# EasyEDA Pro project ProPrj_农装B类小车V2_2025-10-25.epro, board PCB8
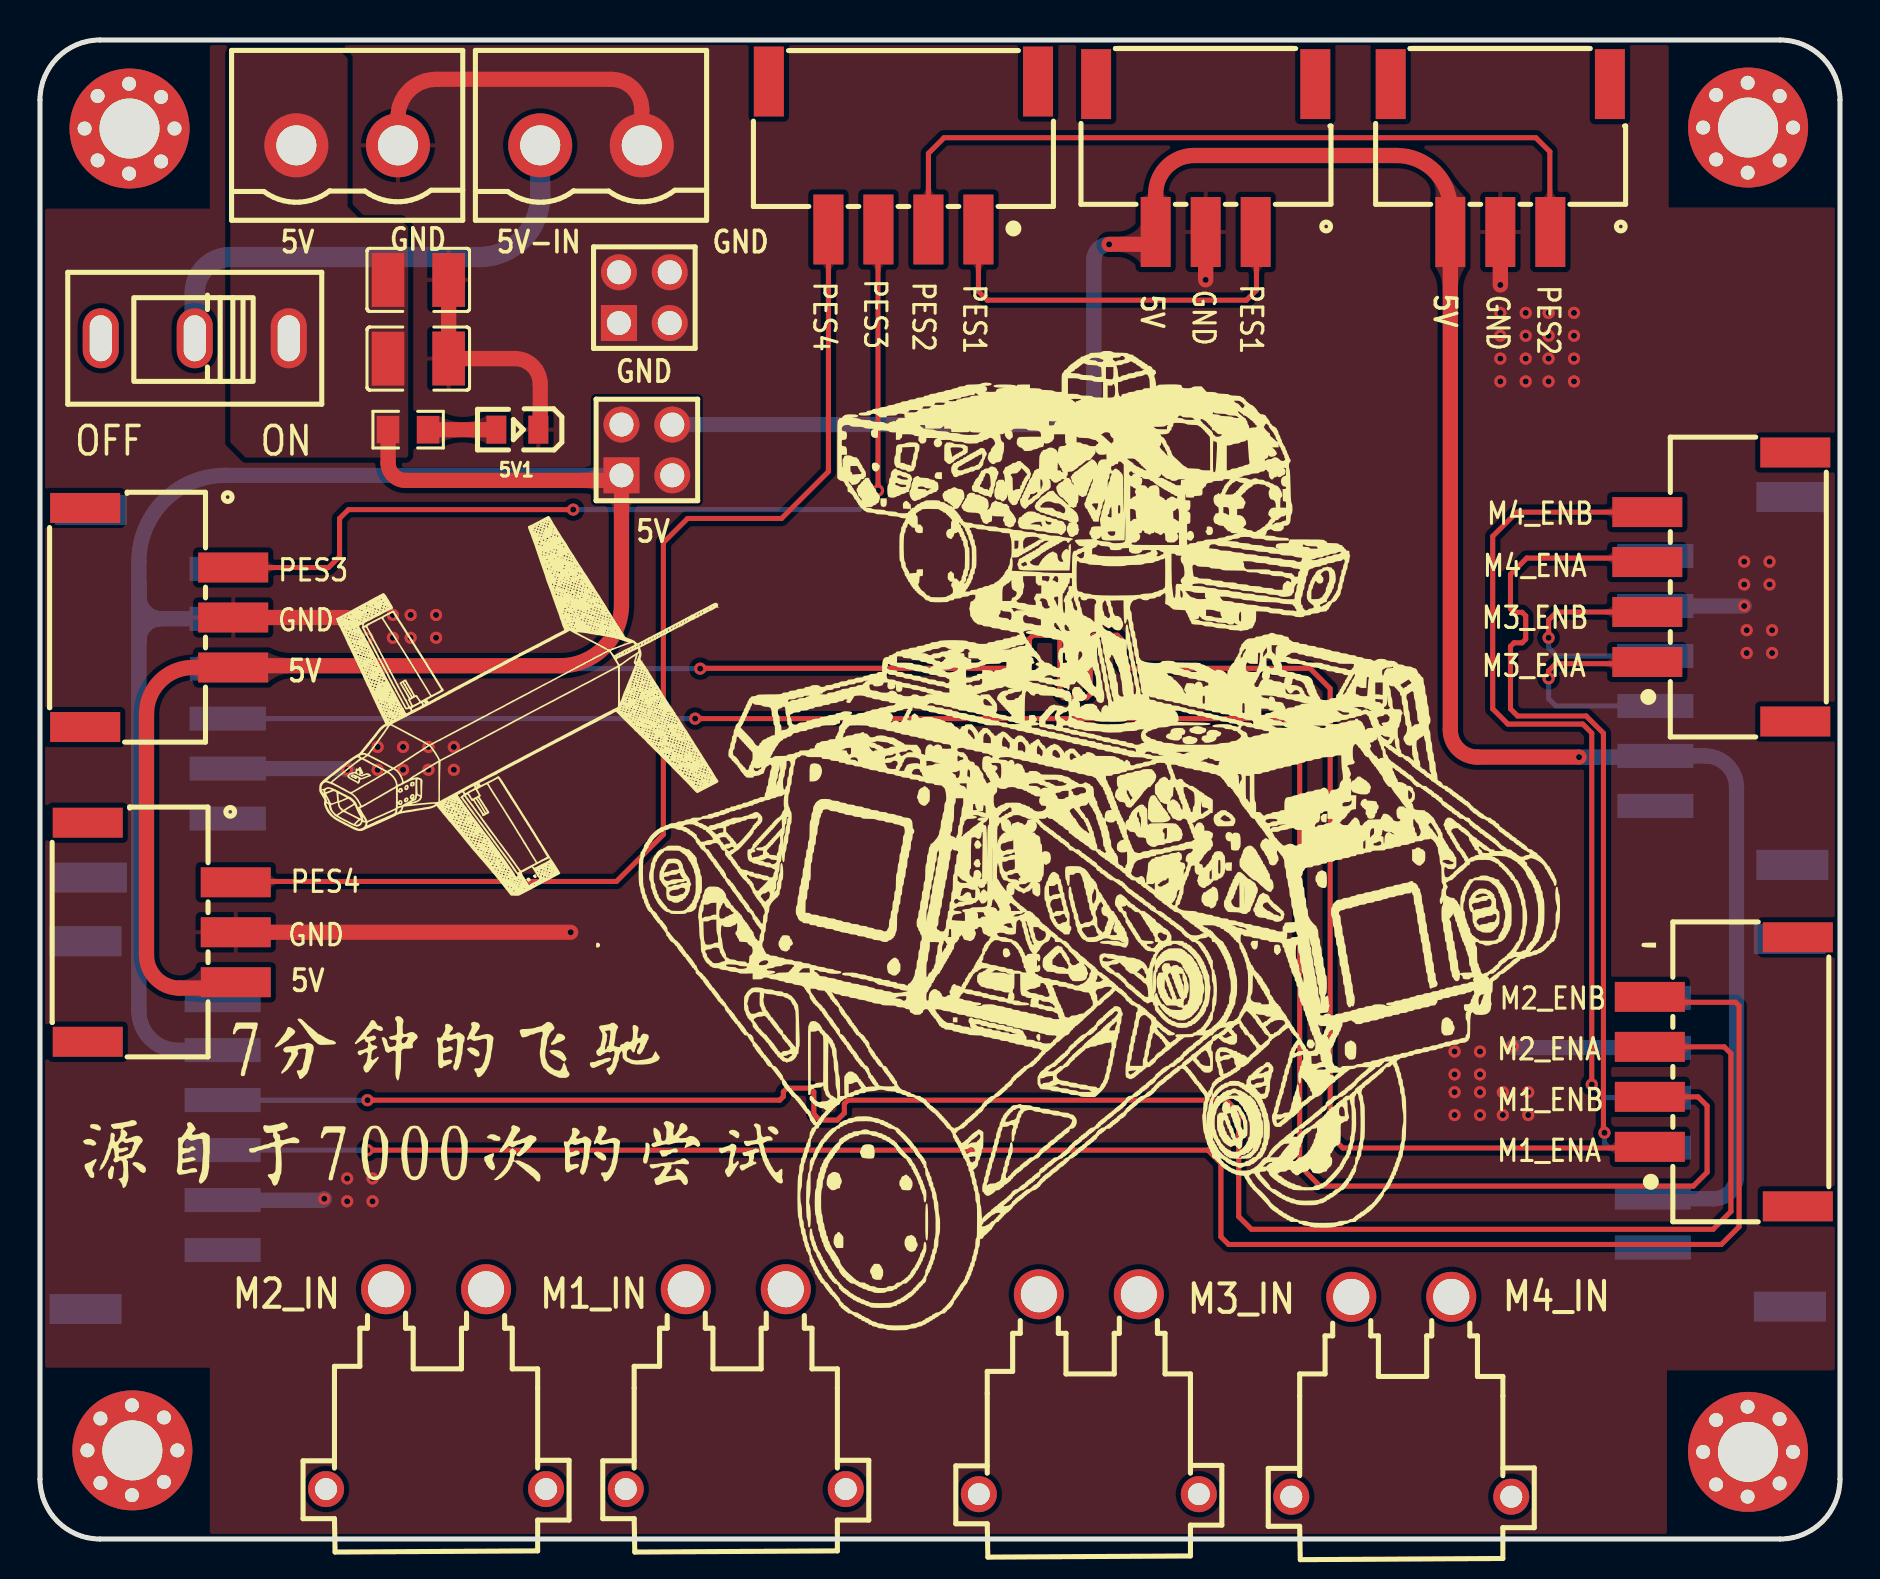
[diagram p4: board, top side]
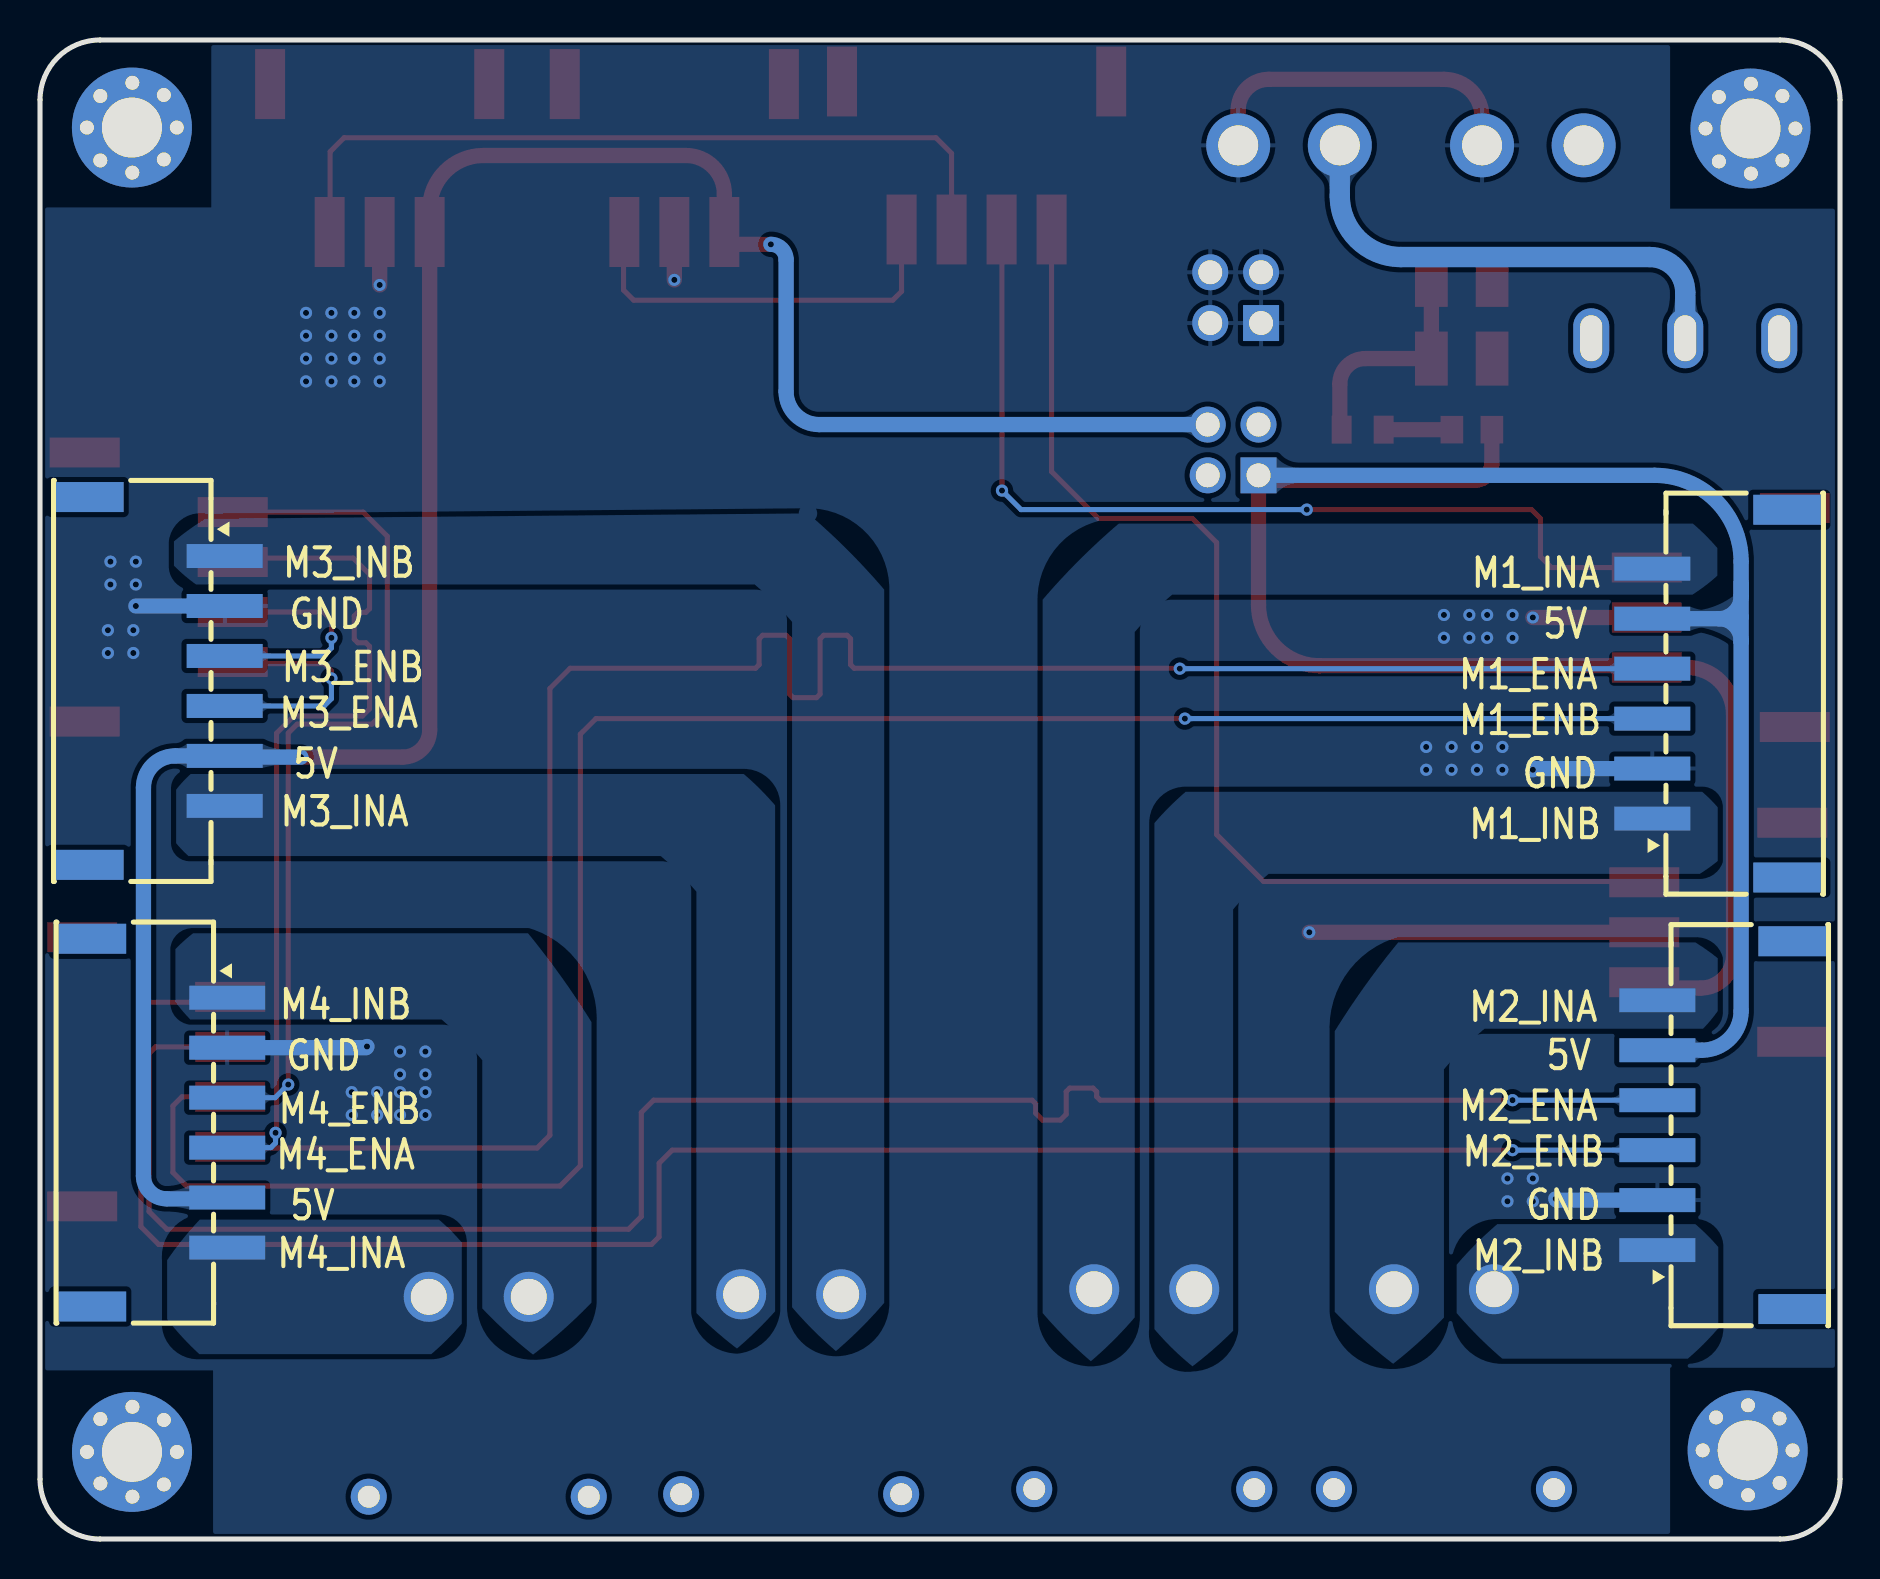
[diagram p5: board, bottom side, seen from below]

Outline 90 x 75 mm; copper layers: Top Layer, Bottom Layer. Coordinates in mm from the lower left corner of the outline.
Outline path: 0,72 arc(0.88,74.12) 3,75 87,75 arc(89.12,74.12) 90,72 90,3 arc(89.12,0.88) 87,0 3,0 arc(0.88,0.88) 0,3 0,72
Stack: Top Layer 0.035mm / Dielectric1 1.51mm FR4 er 4.5 / Bottom Layer 0.035mm

## Design rules (mm)
net M1_ENA: DP2
net M1_ENB: DP2
net M2_ENA: DP1
net M2_ENB: DP1
net M3_ENA: DP3
net M3_ENB: DP3
net M4_ENA: DP4
net M4_ENB: DP4
template: JLCPCB Capability(Two Layers Board)
spacing copperThickness1oz (default): track to track 0.102, other pairs 0.152 to 0.3
spacing copperThickness2oz: track to track 0.203, other pairs 0.152 to 0.3
track width copperThickness1oz (default): min 0.127, default 0.254, max 2.54
track width copperThickness2oz: min 0.203, default 0.254, max 2.54
differential pair differentialPair (default): width min 0.127, default 0.254, max 2.54; gap min 0.152, default 0.152
via viaSize (default): diameter min 0.5, default 0.61, max 10; hole min 0.3, default 0.305, max 6.3

## Placement (name value [footprint] x y rotation side)
5V1  NCD0805R1  [LED0805-R-RD]  23.87 55.5 180 top
C54  100uF  [C1210]  18.91 63 0 top
C55  100uF  [C1210]  18.91 59.06 0 top
CN2  DB2EVC-5.08-2P-GN  [CONN-TH_2P-P5.08_DB2EVC-5.08-2P]  27.55 69.73 180 top
CN15  WAFER-XH2.54-4PWB  [CONN-TH_4P-P0.20_XUNPU_WAFER-XH2.54-4PWB]  43.17 69.22 180 top
CN19  WAFER-XH2.54-3PWB  [CONN-SMD_3P-P2.50_XUNPU_WAFER-XH2.54-3PWB]  58.28 69.09 180 top
CN27  WAFER-XH2.54-3PWB  [CONN-SMD_3P-P2.50_XUNPU_WAFER-XH2.54-3PWB]  73.02 69.09 180 top
CN28  WAFER-XH2.54-3PWB  [CONN-SMD_3P-P2.50_XUNPU_WAFER-XH2.54-3PWB]  5.96 46.11 270 top
CN29  WAFER-XH2.54-3PWB  [CONN-SMD_3P-P2.50_XUNPU_WAFER-XH2.54-3PWB]  6.09 30.36 270 top
CN30  WAFER-XH2.54-4PWB  [CONN-TH_4P-P0.20_XUNPU_WAFER-XH2.54-4PWB]  84.19 23.37 90 top
CN31  WAFER-XH2.54-4PWB  [CONN-TH_4P-P0.20_XUNPU_WAFER-XH2.54-4PWB]  84.07 47.63 90 top
CN49  DB2EVC-5.08-2P-GN  [CONN-TH_2P-P5.08_DB2EVC-5.08-2P]  15.36 69.73 180 top
CN50  XT30PW-M30.G.Y  [CONN-TH_XT30PW-M]  34.79 7.5 0 top
CN51  XT30PW-M30.G.Y  [CONN-TH_XT30PW-M]  68.06 7.12 0 top
CN52  XT30PW-M30.G.Y  [CONN-TH_XT30PW-M]  52.44 7.24 0 top
CN53  XT30PW-M30.G.Y  [CONN-TH_XT30PW-M]  19.8 7.5 0 top
H26  A2541WV-2x2P  [HDR-TH_4P-P2.54-V-R2-C2-S2.54_A2541WV-2X2P]  30.22 62.11 0 top
H27  A2541WV-2x2P  [HDR-TH_4P-P2.54-V-R2-C2-S2.54_A2541WV-2X2P]  30.34 54.49 0 top
NOREF  -  [Pad_e37]  86.98 6.01 0 top
NOREF#2  -  [Pad_e43]  83.81 5.96 0 top
NOREF#3  -  [Pad_e46]  6.2 6.08 0 top
NOREF#4  -  [Pad_e30]  85.38 68.36 0 top
NOREF#5  -  [Pad_e27]  86.98 72.2 180 top
NOREF#6  -  [Pad_e52]  3.02 6.03 0 top
NOREF#7  -  [Pad_e50]  3.02 2.8 0 top
NOREF#8  -  [Pad_e56]  6.73 70.57 270 top
NOREF#9  -  [Pad_e45]  4.6 6.69 180 top
NOREF#10  -  [Pad_e38]  87.65 4.36 270 top
NOREF#11  -  [Pad_e57]  6.06 68.92 180 top
NOREF#12  -  [Pad_e47]  6.87 4.43 270 top
NOREF#13  -  [Pad_e39]  86.98 2.78 0 top
NOREF#14  -  [Pad_e63]  4.48 70.57 0 top
NOREF#15  -  [Pad_e40]  85.38 2.12 180 top
NOREF#16  -  [Pad_e36]  85.38 6.62 180 top
NOREF#17  -  [Pad_e41]  83.81 2.73 0 top
NOREF#18  -  [Pad_e62]  4.46 72.81 0 top
NOREF#19  -  [Pad_e44]  85.4 4.36 180 top
NOREF#20  -  [Pad_e33]  83.81 72.25 180 top
NOREF#21  -  [Pad_e53]  4.62 4.43 180 top
NOREF#22  -  [Pad_e42]  83.16 4.36 270 top
NOREF#23  -  [Pad_e31]  83.81 69.02 180 top
NOREF#24  -  [Pad_e49]  4.6 2.2 180 top
NOREF#25  -  [Pad_e34]  85.41 70.62 0 top
NOREF#26  -  [Pad_e55]  6.06 72.15 180 top
NOREF#27  -  [Pad_e61]  2.88 72.2 180 top
NOREF#28  -  [Pad_e48]  6.2 2.86 0 top
NOREF#29  -  [Pad_e28]  87.66 70.62 270 top
NOREF#30  -  [Pad_e29]  86.98 68.97 180 top
NOREF#31  -  [Pad_e60]  2.23 70.57 270 top
NOREF#32  -  [Pad_e59]  2.88 68.97 180 top
NOREF#33  -  [Pad_e26]  85.38 72.86 0 top
NOREF#34  -  [Pad_e51]  2.37 4.43 270 top
NOREF#35  -  [Pad_e58]  4.46 68.31 0 top
NOREF#36  -  [Pad_e32]  83.16 70.62 270 top
R13_10K1  10K  [R0805]  18.41 55.5 0 top
U8  单刀双掷  [SW-TH_SS-12D10-G050]  7.74 60.08 180 top
U11  2.54-6PWT  [COMM-SMD_6P-P2.50_SHOUHAN_2.54-6PWT]  5.96 42.3 90 bottom
U15  2.54-6PWT  [COMM-SMD_6P-P2.50_SHOUHAN_2.54-6PWT]  5.71 20.71 90 bottom
U16  2.54-6PWT  [COMM-SMD_6P-P2.50_SHOUHAN_2.54-6PWT]  84.19 42.93 270 bottom
U17  2.54-6PWT  [COMM-SMD_6P-P2.50_SHOUHAN_2.54-6PWT]  84.07 20.83 270 bottom

## Footprints (pads in the part's own frame, mm; a bottom-side part is the same pattern mirrored in y, then rotated)
C1210
  rect 1.635x2.7 smd: 1(-1.518,0) 2(1.518,0)
COMM-SMD_6P-P2.50_SHOUHAN_2.54-6PWT
  rect 1.2x3.8 smd: 1(-6.25,3.425) 2(-3.75,3.425) 3(-1.25,3.425) 4(1.25,3.425) 5(3.75,3.425) 6(6.25,3.425)
  rect 1.5x3.6 smd: 7(9.2,-3.425) 8(-9.2,-3.425)
CONN-SMD_3P-P2.50_XUNPU_WAFER-XH2.54-3PWB
  rect 1.5x3.5 smd: 1(-2.5,3.7) 2(0,3.7) 3(2.5,3.7) 4(5.48,-3.7) 5(-5.48,-3.7)
CONN-TH_2P-P5.08_DB2EVC-5.08-2P
  round 3.2 hole 2: 1(-2.54,0) 2(2.54,0)
CONN-TH_4P-P0.20_XUNPU_WAFER-XH2.54-4PWB
  rect 1.5x3.5 smd: 1(-3.75,3.7) 2(-1.25,3.7) 3(1.25,3.7) 4(3.75,3.7) 5(-6.73,-3.7) 6(6.73,-3.7)
CONN-TH_XT30PW-M
  round 2.5 hole 1.8: 1(-2.5,5) 2(2.5,5)
  round 1.8 hole 1.1: 3(5.5,-5) 4(-5.5,-5)
HDR-TH_4P-P2.54-V-R2-C2-S2.54_A2541WV-2X2P
  rect 1.8x1.8 hole 1.2: 1(-1.27,-1.27)
  round 1.8 hole 1.2: 2(-1.27,1.27) 3(1.27,-1.27) 4(1.27,1.27)
LED0805-R-RD
  rect 1x1.399 smd: 1(1.05,0) 2(-1.05,0)
Pad_e26
  round 1.2 hole 0.7: 1(0,0)
Pad_e27
  round 1.2 hole 0.7: 1(0,0)
Pad_e28
  round 1.2 hole 0.7: 1(0,0)
Pad_e29
  round 1.2 hole 0.7: 1(0,0)
Pad_e30
  round 1.2 hole 0.7: 1(0,0)
Pad_e31
  round 1.2 hole 0.7: 1(0,0)
Pad_e32
  round 1.2 hole 0.7: 1(0,0)
Pad_e33
  round 1.2 hole 0.7: 1(0,0)
Pad_e34
  round 6 hole 3: 1(0,0)
Pad_e36
  round 1.2 hole 0.7: 1(0,0)
Pad_e37
  round 1.2 hole 0.7: 1(0,0)
Pad_e38
  round 1.2 hole 0.7: 1(0,0)
Pad_e39
  round 1.2 hole 0.7: 1(0,0)
Pad_e40
  round 1.2 hole 0.7: 1(0,0)
Pad_e41
  round 1.2 hole 0.7: 1(0,0)
Pad_e42
  round 1.2 hole 0.7: 1(0,0)
Pad_e43
  round 1.2 hole 0.7: 1(0,0)
Pad_e44
  round 6 hole 3: 1(0,0)
Pad_e45
  round 1.2 hole 0.7: 1(0,0)
Pad_e46
  round 1.2 hole 0.7: 1(0,0)
Pad_e47
  round 1.2 hole 0.7: 1(0,0)
Pad_e48
  round 1.2 hole 0.7: 1(0,0)
Pad_e49
  round 1.2 hole 0.7: 1(0,0)
Pad_e50
  round 1.2 hole 0.7: 1(0,0)
Pad_e51
  round 1.2 hole 0.7: 1(0,0)
Pad_e52
  round 1.2 hole 0.7: 1(0,0)
Pad_e53
  round 6 hole 3: 1(0,0)
Pad_e55
  round 1.2 hole 0.7: 1(0,0)
Pad_e56
  round 1.2 hole 0.7: 1(0,0)
Pad_e57
  round 1.2 hole 0.7: 1(0,0)
Pad_e58
  round 1.2 hole 0.7: 1(0,0)
Pad_e59
  round 1.2 hole 0.7: 1(0,0)
Pad_e60
  round 1.2 hole 0.7: 1(0,0)
Pad_e61
  round 1.2 hole 0.7: 1(0,0)
Pad_e62
  round 1.2 hole 0.7: 1(0,0)
Pad_e63
  round 6 hole 3: 1(0,0)
R0805
  rect 1.133x1.377 smd: 1(-1,0) 2(1,0)
SW-TH_SS-12D10-G050
  oval 1.8x3 hole 1.1x2.3: 1(-4.7,0) 2(0,0) 3(4.7,0)

## Nets
GND: 5V1.2 C54.2 C55.2 CN2.1 CN19.2 CN27.2 CN28.2 CN29.2 CN49.1 H26.1 H26.2 H26.3 H26.4 U11.2 U15.2 U16.2 U17.2
VCC5V: C54.1 C55.1 CN19.3 CN27.3 CN28.3 CN29.3 CN49.2 H27.1 H27.2 H27.3 H27.4 R13_10K1.1 U8.1 U11.5 U15.5 U16.5 U17.5
M1_ENA: CN30.1 U11.4
M1_ENB: CN30.2 U11.3
M1_INA: CN50.2 U11.6
M1_INB: CN50.1 U11.1
M2_ENA: CN30.3 U15.4
M2_ENB: CN30.4 U15.3
M2_INA: CN53.2 U15.6
M2_INB: CN53.1 U15.1
M3_ENA: CN31.1 U16.4
M3_ENB: CN31.2 U16.3
M3_INA: CN52.2 U16.6
M3_INB: CN52.1 U16.1
M4_ENA: CN31.3 U17.4
M4_ENB: CN31.4 U17.3
M4_INA: CN51.2 U17.6
M4_INB: CN51.1 U17.1
PES1: CN15.1 CN19.1
PES2: CN15.2 CN27.1
PES3: CN15.3 CN28.1
PES4: CN15.4 CN29.1
POWER5V_IN: CN2.2 U8.2
$1N4707: 5V1.1 R13_10K1.2

Pads without a net: CN15 5 6; CN19 4 5; CN27 4 5; CN28 4 5; CN29 4 5; CN30 5 6; CN31 5 6; CN50 3 4; CN51 3 4; CN52 3 4; CN53 3 4; NOREF 1; NOREF#2 1; NOREF#3 1; NOREF#4 1; NOREF#5 1; NOREF#6 1; NOREF#7 1; NOREF#8 1; NOREF#9 1; NOREF#10 1; NOREF#11 1; NOREF#12 1; NOREF#13 1; NOREF#14 1; NOREF#15 1; NOREF#16 1; NOREF#17 1; NOREF#18 1; NOREF#19 1; NOREF#20 1; NOREF#21 1; NOREF#22 1; NOREF#23 1; NOREF#24 1; NOREF#25 1; NOREF#26 1; NOREF#27 1; NOREF#28 1; NOREF#29 1; NOREF#30 1; NOREF#31 1; NOREF#32 1; NOREF#33 1; NOREF#34 1; NOREF#35 1; NOREF#36 1; U8 3; U11 7 8; U15 7 8; U16 7 8; U17 7 8

## Via types
v1: diameter 0.61, hole 0.305, Top Layer to Bottom Layer, 76 vias

## Routing (per net, layer and track width the routed paths; a pad name or vN(x,y) marks a point on that pad's centre or on a via; arc(x,y) is an arc through that point)
GND: length 79
  Top Layer w0.762: C54.2 C55.2 23.74,59.06 arc(24.64,58.69) 25.01,57.79 25.01,55.6 arc(24.98,55.53) 5V1.2 ; CN27.2 v1(73.02,62.74) ; CN2.1 30.09,71.51 arc(29.64,72.58) 28.57,73.03 19.8,73.03 arc(18.46,72.47) 17.9,71.12 CN49.1 ; CN29.2 v1(26.53,30.36) ; CN28.2 v1(15.36,46.11) ; CN19.2 v1(58.28,63)
  Bottom Layer w0.762: U11.2 15.3,38.55 arc(15.34,38.53) v1(15.36,38.49) ; U17.2 73.71,24.58 arc(73.67,24.6) v1(73.65,24.64) ; U15.2 14.15,16.96 arc(14.2,16.98) v1(14.22,17.02) ; U16.2 v1(85.21,46.68)
  vias: v1(15.36,18.04) v1(15.36,16.9) v1(16.37,46.23) v1(16.37,45.09) v1(16.63,18.04) v1(16.63,16.9) v1(16.88,39.63) v1(16.88,38.49) v1(17.64,46.23) v1(17.64,45.09) v1(18.15,39.63) v1(18.15,38.49) v1(18.53,46.23) v1(18.53,45.09) v1(19.42,39.63) v1(19.42,38.49) v1(19.8,46.23) v1(19.8,45.09) v1(20.69,39.63) v1(20.69,38.49) v1(70.73,24.39) v1(70.73,23.25) v1(70.73,22.36) v1(70.73,21.21) v1(72,24.39) v1(72,23.25) v1(72,22.36) v1(72,21.21) v1(73.02,61.35) v1(73.02,60.2) v1(73.02,59.06) v1(73.02,57.92) v1(73.14,22.36) v1(73.14,21.21) v1(74.29,61.35) v1(74.29,60.2) v1(74.29,59.06) v1(74.29,57.92) v1(74.41,22.36) v1(74.41,21.21) v1(75.43,61.35) v1(75.43,60.2) v1(75.43,59.06) v1(75.43,57.92) v1(76.7,61.35) v1(76.7,60.2) v1(76.7,59.06) v1(76.7,57.92) v1(85.21,48.9) v1(85.21,47.76) v1(85.34,45.47) v1(85.34,44.33) v1(86.48,48.9) v1(86.48,47.76) v1(86.61,45.47) v1(86.61,44.33)
VCC5V: length 246.3
  Top Layer w0.762: v1(53.46,64.77) 55.17,64.77 arc(55.6,64.96) CN19.3 55.78,67.3 arc(56.35,68.66) 57.71,69.22 67.83,69.22 arc(69.73,68.43) 70.52,66.54 CN27.3 70.52,40.48 arc(70.91,39.52) 71.87,39.12 v1(76.95,39.12) ; R13_10K1.1 17.41,53.84 arc(17.66,53.22) 18.28,52.96 28.82,52.96 arc(29,53.04) 29.07,53.22 29.07,46.74 arc(28.18,44.59) 26.03,43.69 9.75,43.69 arc(9.69,43.67) CN28.3 7.65,43.61 arc(6.01,42.92) 5.33,41.28 5.33,29.21 arc(5.81,28.05) 6.98,27.56 9.49,27.56 arc(9.7,27.65) CN29.3 ; 29.09,55.77 arc(29.09,55.76) 29.07,55.76
  Bottom Layer w0.762: 4.94,47.85 4.94,47.17 arc(5.27,46.38) 6.07,46.05 ; 4.94,44.85 4.94,44.93 arc(5.27,45.72) 6.06,46.05 ; H27.4 51.05,55.76 arc(52.21,56.24) 52.7,57.41 52.7,64.01 arc(52.92,64.55) v1(53.46,64.77) ; 4.94,46.13 4.94,26.42 arc(5.52,25.03) 6.91,24.46 U15.5 ; 4.94,46.13 4.94,48.9 arc(6.21,51.95) 9.26,53.22 29.07,53.22 ; 4.94,46.13 arc(4.97,46.07) 5.02,46.05 U11.5 ; v1(76.95,39.12) 80.71,39.12 arc(80.75,39.14) U16.5 83.24,39.18 arc(84.36,38.72) 84.83,37.6 84.83,18.17 arc(84.49,17.36) 83.68,17.02 80.7,17.02 arc(80.66,17.04) U17.5
M1_ENA: length 102.9
  Top Layer w0.254: v1(33.01,43.55) 33.03,43.57 49.29,43.57 49.47,43.75 49.47,45.04 49.65,45.22 50.82,45.22 51,45.04 51,42.27 51.18,42.09 52.34,42.09 52.52,42.27 52.52,45.04 52.7,45.22 53.86,45.22 54.04,45.04 54.04,43.75 54.22,43.57 63.49,43.57 64.51,42.55 64.51,20.2 65.14,19.56 80.43,19.56 CN30.1
  Bottom Layer w0.254: U11.4 v1(33.01,43.55)
M1_ENB: length 103
  Top Layer w0.254: CN30.2 82.9,22.12 83.36,21.67 83.36,18.35 82.67,17.66 64,17.66 62.98,18.67 62.98,40.26 62.2,41.05 v1(32.76,41.05)
  Bottom Layer w0.254: U11.3 v1(32.76,41.05)
M2_ENA: length 96
  Top Layer w0.254: CN30.3 84.21,24.62 84.55,24.29 84.55,16.39 83.66,15.5 60.57,15.5 59.94,16.13 59.94,21.34 59.32,21.96 40.4,21.96 40.22,21.78 40.22,21.31 39.87,20.96 38.98,20.96 38.69,21.25 38.69,22.38 38.51,22.56 37.35,22.56 37.17,22.38 37.17,22.14 36.99,21.96 v1(16.37,21.96)
  Bottom Layer w0.254: U15.4 v1(16.37,21.96)
M2_ENB: length 96
  Top Layer w0.254: CN30.4 80.76,26.85 84.78,26.85 84.95,26.67 84.95,15.63 84.07,14.74 59.43,14.74 59.05,15.12 59.05,18.8 58.39,19.46 v1(16.37,19.46)
  Bottom Layer w0.254: U15.3 v1(16.37,19.46)
M3_ENA: length 12
  Top Layer w0.254: CN31.1 80.28,43.79 75.79,43.79 75.43,43.44 v1(75.43,43.06)
  Bottom Layer w0.254: v1(75.43,43.06) 75.43,42.04 75.79,41.68 U16.4
M3_ENB: length 12
  Top Layer w0.254: CN31.2 75.83,46.38 75.43,45.98 v1(75.43,45.09)
  Bottom Layer w0.254: v1(75.43,45.09) 75.43,44.58 75.83,44.18 U16.3
M4_ENA: length 43.3
  Top Layer w0.254: CN31.3 80.17,49.08 74.34,49.08 73.52,48.26 73.52,46.54 73.7,46.36 74.11,46.36 74.29,46.18 74.29,45.02 74.11,44.84 73.7,44.84 73.52,44.66 73.52,41.53 73.88,41.18 77.31,41.18 78.17,40.31 78.17,20.38 v1(78.22,20.32)
  Bottom Layer w0.254: v1(78.22,20.32) 78.22,19.82 78.46,19.58 U17.4
M4_ENB: length 43.2
  Top Layer w0.254: CN31.4 80.36,51.38 73.84,51.38 72.64,50.17 72.64,41.53 73.4,40.77 77.14,40.77 77.59,40.32 v1(77.59,22.74)
  Bottom Layer w0.254: U17.3 78.24,22.08 v1(77.59,22.74)
PES1: length 20.3
  Top Layer w0.254: CN19.1 60.82,65.35 60.82,62.49 60.32,61.98 47.36,61.98 46.92,62.42 CN15.1
PES2: length 39.5
  Top Layer w0.254: CN15.2 44.42,69.33 45.2,70.11 74.79,70.11 75.49,69.41 75.49,65.42 CN27.1
PES3: length 48
  Top Layer w0.254: v1(26.66,51.5) 15.42,51.5 14.98,51.06 14.98,49.15 14.43,48.61 CN28.1 ; v1(41.9,52.46) 41.9,65.5 CN15.3
  Bottom Layer w0.254: v1(26.66,51.5) 40.95,51.5 v1(41.9,52.46)
PES4: length 58.8
  Top Layer w0.254: CN29.1 9.83,32.9 28.82,32.9 31.17,35.25 31.17,49.85 32.38,51.06 37.08,51.06 39.42,53.4 CN15.4
POWER5V_IN: length 24.9
  Bottom Layer w1.016: CN2.2 25.01,67.19 arc(24.12,65.03) 21.96,64.14 9.52,64.14 arc(8.26,63.62) 7.74,62.36 U8.2
$1N4707: length 3.4
  Top Layer w0.762: R13_10K1.2 5V1.1

## Copper pours and planes (outline as drawn; the poured copper is in the pictures)
GND on Top Layer: -3.82,78.36 95.24,78.36 95.24,-4.06 -3.82,-4.06
GND on Top Layer: 27.17,72.01 33.9,72.01 33.9,58.55 27.17,58.55
GND on Bottom Layer: -4.07,79 92.7,79 92.7,-6.35 -4.07,-6.35
VCC5V on Top Layer: 27.8,57.03 32.88,57.03 32.88,51.95 27.8,51.95
VCC5V on Top Layer: 9.52,74.48 18.41,74.48 18.41,54.11 9.52,54.11
M1_INA on Bottom Layer: 6.13,50.8 39.87,50.8 39.87,8.89 6.13,8.89
M1_INB on Bottom Layer: 6.11,37.38 34.28,37.38 34.28,8.64 6.11,8.64
M2_INA on Bottom Layer: 6.11,29.85 25.26,29.85 25.26,8.77 6.11,8.77
M2_INB on Bottom Layer: 6.09,15.75 19.17,15.75 19.17,9.02 6.09,9.02
M3_INA on Bottom Layer: 53.25,38.27 83.19,38.27 83.19,9.53 53.25,9.53
M3_INB on Bottom Layer: 47.79,51.31 83.3,51.31 83.3,9.4 47.79,9.4
M4_INA on Bottom Layer: 68.91,15.98 83.64,15.98 83.64,9.25 68.91,9.25
M4_INB on Bottom Layer: 62.43,30.31 83.23,30.31 83.23,9.23 62.43,9.23

Small or netless copper shapes (teardrops, artwork), in the pictures only: 37 on Top Layer, 28 on Bottom Layer

## Text on the board
Bottom Silkscreen Layer: M2_ENB | M1_ENA | M1_ENB | M2_ENA | M3_ENB | M3_ENA | M4_ENB | M4_ENA | 5V | GND | M2_INB | M1_INA | M1_INB | M2_INA | M3_INB | M3_INA | M4_INB | M4_INA
Top Silkscreen Layer: PES4 | PES3 | PES1 | GND | PES2 | M3_ENB | M3_ENA | M4_ENA | M4_ENB | M2_ENA | M1_ENB | M1_ENA | M2_ENB | 5V | 5V-IN | OFF | ON | M2_IN | M1_IN | M3_IN | M4_IN
